# Altium schematic sheet 3_PowerDistribution.SchDoc
size A3; SheetNumber: 3; SheetTotal: 8
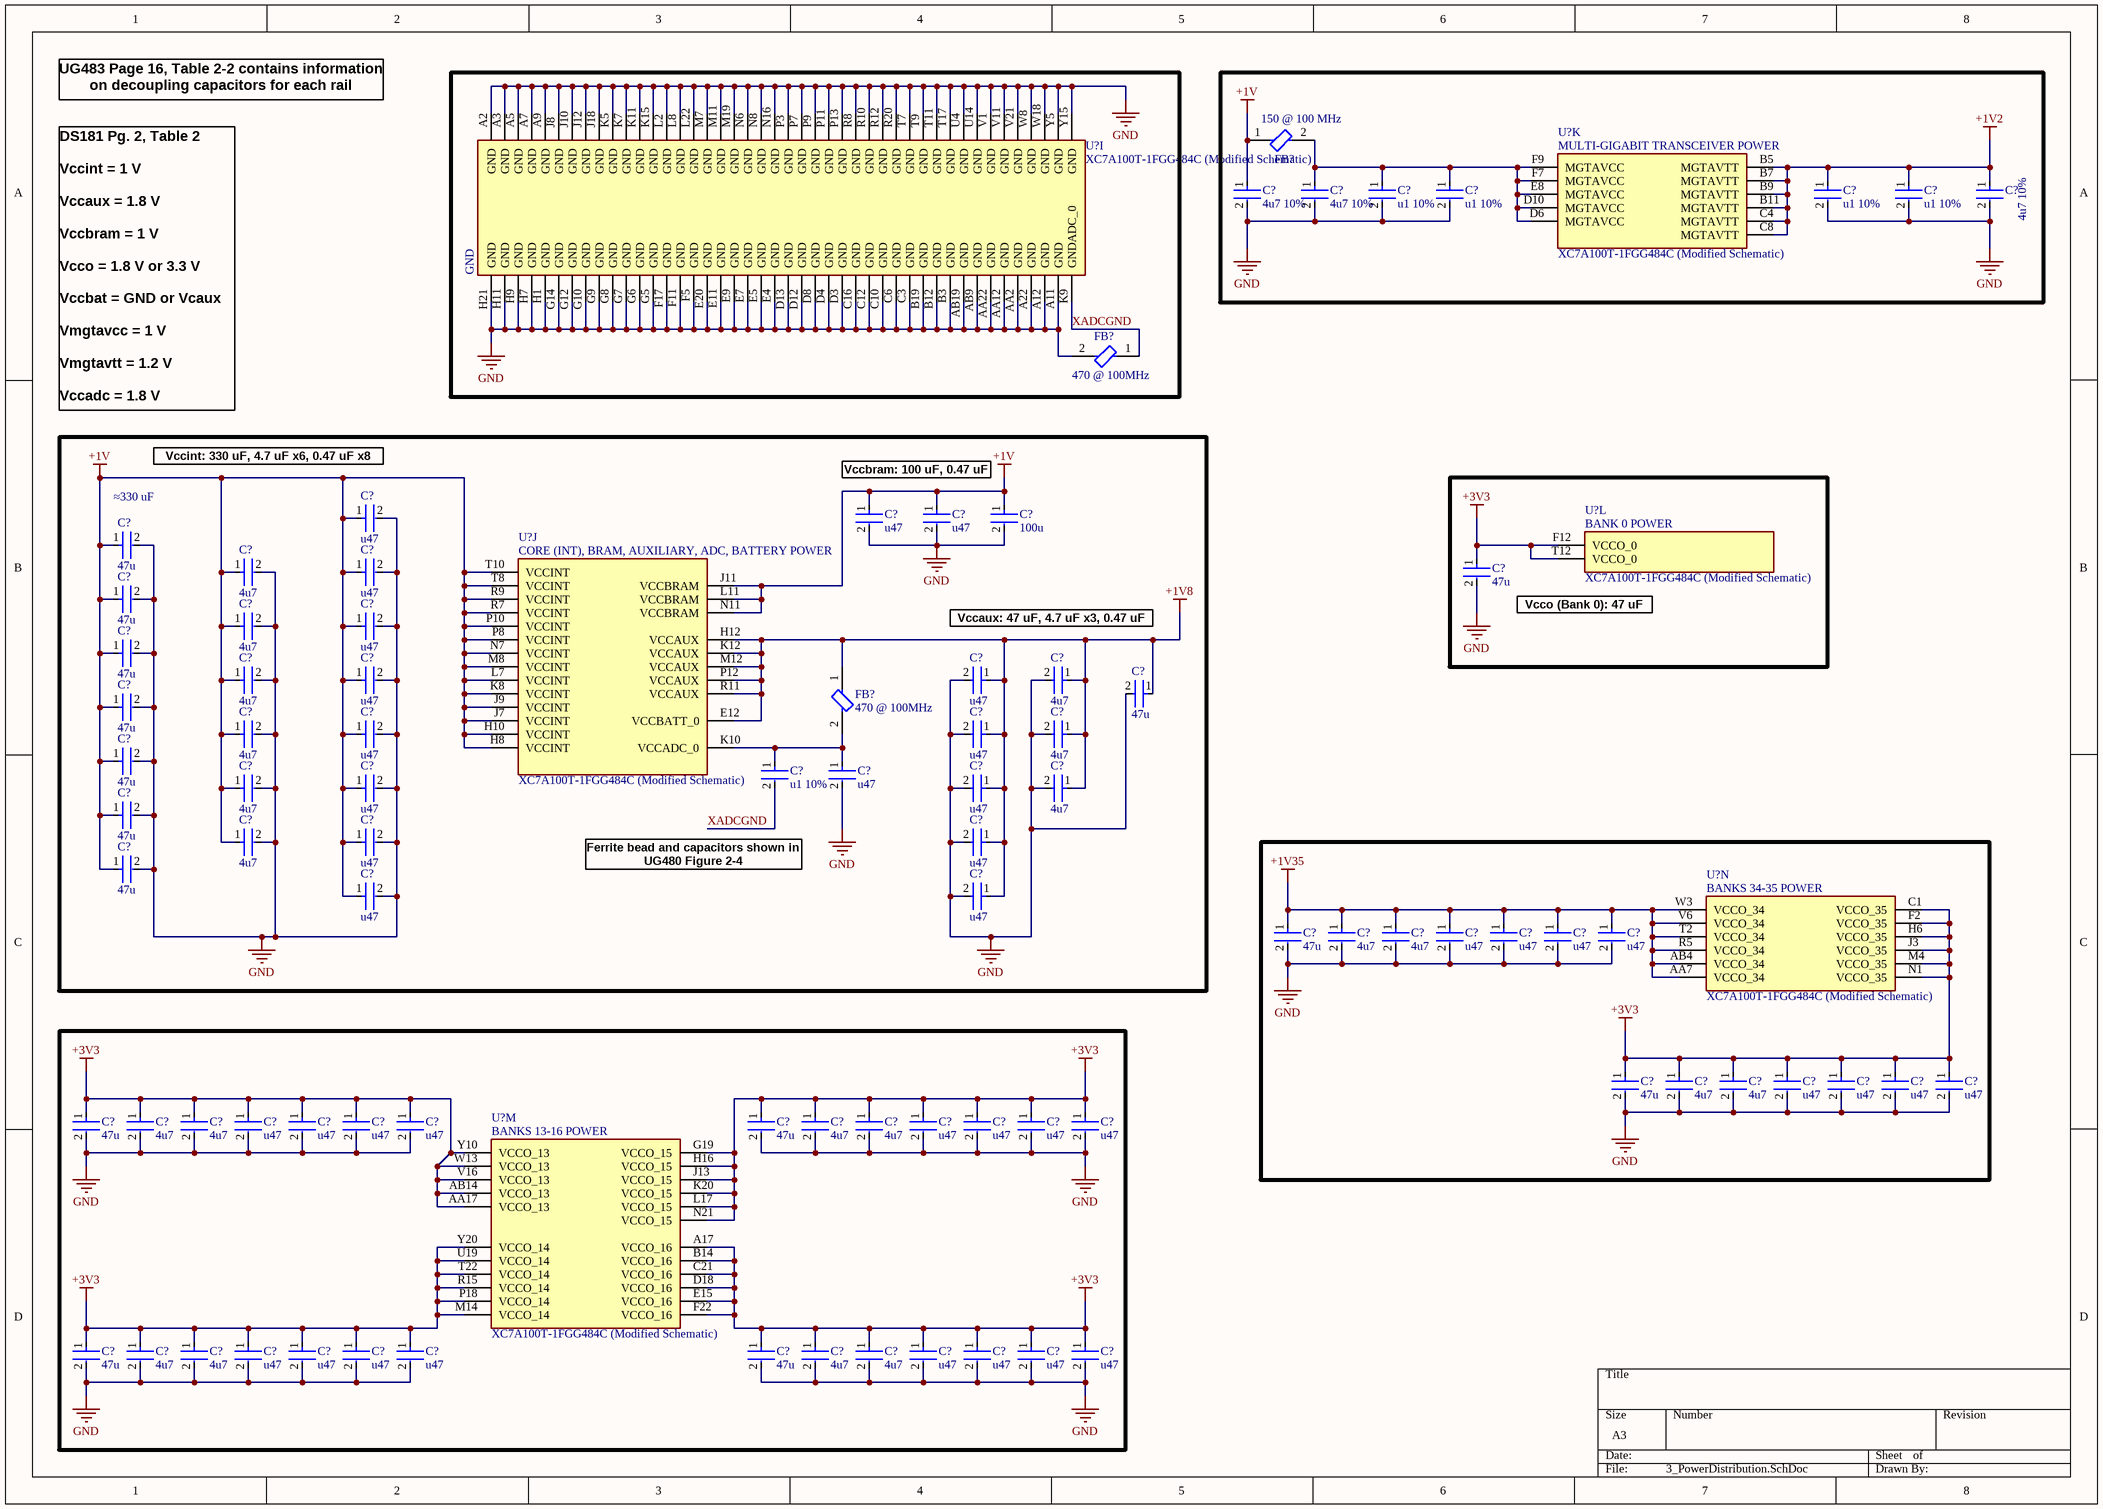
[diagram p0: 3_PowerDistribution.SchDoc]

## Parts
(Parts that share a designator on the sheet are numbered #1, #2 ... from top to bottom, then left to right.)
C?#1  4u7 10%  [FP-C1005-050-0_20-0_10-MFG]
C?#2  4u7 10%  [FP-C1005-050-0_20-0_10-MFG]
C?#3  u1 10%  [FP-CL891-IPC_C]
C?#4  u1 10%  [FP-CL891-IPC_C]
C?#5  u1 10%  [FP-CL891-IPC_C]
C?#6  u1 10%  [FP-CL891-IPC_C]
C?#7  4u7 10%  [FP-C1005-050-0_20-0_10-MFG]
C?#8  u47  [FP-C0603-030-0_03-IPC_A]
C?#9  u47  [FP-C0603-030-0_03-IPC_A]
C?#10  100u  [FP-GRM21B-0_2-e0_2_0_7-IPC_A]
C?#11  u47  [FP-C0603-030-0_03-IPC_A]
C?#12  47u  [FP-GRM188-0_2-IPC_B]
C?#13  47u  [FP-GRM188-0_2-IPC_B]
C?#14  4u7  [FP-CL829-IPC_C]
C?#15  u47  [FP-C0603-030-0_03-IPC_A]
C?#16  47u  [FP-GRM188-0_2-IPC_B]
C?#17  4u7  [FP-CL829-IPC_C]
C?#18  u47  [FP-C0603-030-0_03-IPC_A]
C?#19  47u  [FP-GRM188-0_2-IPC_B]
C?#20  4u7  [FP-CL829-IPC_C]
C?#21  u47  [FP-C0603-030-0_03-IPC_A]
C?#22  u47  [FP-C0603-030-0_03-IPC_A]
C?#23  4u7  [FP-CL829-IPC_C]
C?#24  47u  [FP-GRM188-0_2-IPC_B]
C?#25  47u  [FP-GRM188-0_2-IPC_B]
C?#26  4u7  [FP-CL829-IPC_C]
C?#27  u47  [FP-C0603-030-0_03-IPC_A]
C?#28  u47  [FP-C0603-030-0_03-IPC_A]
C?#29  4u7  [FP-CL829-IPC_C]
C?#30  47u  [FP-GRM188-0_2-IPC_B]
C?#31  u1 10%  [FP-CL891-IPC_C]
C?#32  u47  [FP-C0603-030-0_03-IPC_A]
C?#33  4u7  [FP-CL829-IPC_C]
C?#34  u47  [FP-C0603-030-0_03-IPC_A]
C?#35  u47  [FP-C0603-030-0_03-IPC_A]
C?#36  4u7  [FP-CL829-IPC_C]
C?#37  47u  [FP-GRM188-0_2-IPC_B]
C?#38  4u7  [FP-CL829-IPC_C]
C?#39  u47  [FP-C0603-030-0_03-IPC_A]
C?#40  u47  [FP-C0603-030-0_03-IPC_A]
C?#41  47u  [FP-GRM188-0_2-IPC_B]
C?#42  u47  [FP-C0603-030-0_03-IPC_A]
C?#43  u47  [FP-C0603-030-0_03-IPC_A]
C?#44  47u  [FP-GRM188-0_2-IPC_B]
C?#45  4u7  [FP-CL829-IPC_C]
C?#46  4u7  [FP-CL829-IPC_C]
C?#47  u47  [FP-C0603-030-0_03-IPC_A]
C?#48  u47  [FP-C0603-030-0_03-IPC_A]
C?#49  u47  [FP-C0603-030-0_03-IPC_A]
C?#50  u47  [FP-C0603-030-0_03-IPC_A]
C?#51  47u  [FP-GRM188-0_2-IPC_B]
C?#52  4u7  [FP-CL829-IPC_C]
C?#53  4u7  [FP-CL829-IPC_C]
C?#54  u47  [FP-C0603-030-0_03-IPC_A]
C?#55  u47  [FP-C0603-030-0_03-IPC_A]
C?#56  u47  [FP-C0603-030-0_03-IPC_A]
C?#57  u47  [FP-C0603-030-0_03-IPC_A]
C?#58  47u  [FP-GRM188-0_2-IPC_B]
C?#59  4u7  [FP-CL829-IPC_C]
C?#60  4u7  [FP-CL829-IPC_C]
C?#61  u47  [FP-C0603-030-0_03-IPC_A]
C?#62  u47  [FP-C0603-030-0_03-IPC_A]
C?#63  u47  [FP-C0603-030-0_03-IPC_A]
C?#64  u47  [FP-C0603-030-0_03-IPC_A]
C?#65  47u  [FP-GRM188-0_2-IPC_B]
C?#66  4u7  [FP-CL829-IPC_C]
C?#67  4u7  [FP-CL829-IPC_C]
C?#68  u47  [FP-C0603-030-0_03-IPC_A]
C?#69  u47  [FP-C0603-030-0_03-IPC_A]
C?#70  u47  [FP-C0603-030-0_03-IPC_A]
C?#71  u47  [FP-C0603-030-0_03-IPC_A]
C?#72  47u  [FP-GRM188-0_2-IPC_B]
C?#73  4u7  [FP-CL829-IPC_C]
C?#74  4u7  [FP-CL829-IPC_C]
C?#75  u47  [FP-C0603-030-0_03-IPC_A]
C?#76  u47  [FP-C0603-030-0_03-IPC_A]
C?#77  u47  [FP-C0603-030-0_03-IPC_A]
C?#78  u47  [FP-C0603-030-0_03-IPC_A]
C?#79  47u  [FP-GRM188-0_2-IPC_B]
C?#80  4u7  [FP-CL829-IPC_C]
C?#81  4u7  [FP-CL829-IPC_C]
C?#82  u47  [FP-C0603-030-0_03-IPC_A]
C?#83  u47  [FP-C0603-030-0_03-IPC_A]
C?#84  u47  [FP-C0603-030-0_03-IPC_A]
C?#85  u47  [FP-C0603-030-0_03-IPC_A]
FB?#1  150 @ 100 MHz  [FP-MPZ1005-IPC_B]
FB?#2  470 @ 100MHz  [FP-BLM41-0_2-a1_2-IPC_B]
FB?#3  470 @ 100MHz  [FP-BLM41-0_2-a1_2-IPC_B]
U?#1  XC7A100T-1FGG484C (Modified Schematic)  [BGA484C100P22X22_2300X2300X260N]  (part I of 14)
U?#2  XC7A100T-1FGG484C (Modified Schematic)  [BGA484C100P22X22_2300X2300X260N]  (part K of 14)
U?#3  XC7A100T-1FGG484C (Modified Schematic)  [BGA484C100P22X22_2300X2300X260N]  (part L of 14)
U?#4  XC7A100T-1FGG484C (Modified Schematic)  [BGA484C100P22X22_2300X2300X260N]  (part J of 14)
U?#5  XC7A100T-1FGG484C (Modified Schematic)  [BGA484C100P22X22_2300X2300X260N]  (part N of 14)
U?#6  XC7A100T-1FGG484C (Modified Schematic)  [BGA484C100P22X22_2300X2300X260N]  (part M of 14)

## Blocks framed on the sheet
≈330 uF: C?#8-C?#12 C?#14-C?#43 FB?#3 U?#4

## Nets
+1V: C?#1.1 C?#8.1 C?#9.1 C?#10.1 C?#11.1 C?#12.1 C?#14.1 C?#15.1 C?#16.1 C?#17.1 C?#18.1 C?#19.1 C?#20.1 C?#21.1 C?#25.1 C?#26.1 C?#27.1 C?#30.1 C?#33.1 C?#34.1 C?#37.1 C?#38.1 C?#39.1 C?#41.1 C?#42.1 FB?#1.1 U?#4.H8(VCCINT) U?#4.H10(VCCINT) U?#4.J7(VCCINT) U?#4.J9(VCCINT) U?#4.J11(VCCBRAM) U?#4.K8(VCCINT) U?#4.L7(VCCINT) U?#4.L11(VCCBRAM) U?#4.M8(VCCINT) U?#4.N7(VCCINT) U?#4.N11(VCCBRAM) U?#4.P8(VCCINT) U?#4.P10(VCCINT) U?#4.R7(VCCINT) U?#4.R9(VCCINT) U?#4.T8(VCCINT) U?#4.T10(VCCINT)
+1V2: C?#5.1 C?#6.1 C?#7.1 U?#2.B5(MGTAVTT) U?#2.B7(MGTAVTT) U?#2.B9(MGTAVTT) U?#2.B11(MGTAVTT) U?#2.C4(MGTAVTT) U?#2.C8(MGTAVTT)
+1V8: C?#22.1 C?#23.1 C?#24.1 C?#28.1 C?#29.1 C?#35.1 C?#36.1 C?#40.1 C?#43.1 FB?#3.1 U?#4.E12(VCCBATT_0) U?#4.H12(VCCAUX) U?#4.K12(VCCAUX) U?#4.M12(VCCAUX) U?#4.P12(VCCAUX) U?#4.R11(VCCAUX)
+1V35: C?#44.1 C?#45.1 C?#46.1 C?#47.1 C?#48.1 C?#49.1 C?#50.1 U?#5.AA7(VCCO_34) U?#5.AB4(VCCO_34) U?#5.R5(VCCO_34) U?#5.T2(VCCO_34) U?#5.V6(VCCO_34) U?#5.W3(VCCO_34)
+3V3: C?#13.1 C?#51.1 C?#52.1 C?#53.1 C?#54.1 C?#55.1 C?#56.1 C?#57.1 C?#58.1 C?#59.1 C?#60.1 C?#61.1 C?#62.1 C?#63.1 C?#64.1 C?#65.1 C?#66.1 C?#67.1 C?#68.1 C?#69.1 C?#70.1 C?#71.1 C?#72.1 C?#73.1 C?#74.1 C?#75.1 C?#76.1 C?#77.1 C?#78.1 C?#79.1 C?#80.1 C?#81.1 C?#82.1 C?#83.1 C?#84.1 C?#85.1 U?#3.F12(VCCO_0) U?#3.T12(VCCO_0) U?#5.C1(VCCO_35) U?#5.F2(VCCO_35) U?#5.H6(VCCO_35) U?#5.J3(VCCO_35) U?#5.M4(VCCO_35) U?#5.N1(VCCO_35) U?#6.A17(VCCO_16) U?#6.AA17(VCCO_13) U?#6.AB14(VCCO_13) U?#6.B14(VCCO_16) U?#6.C21(VCCO_16) U?#6.D18(VCCO_16) U?#6.E15(VCCO_16) U?#6.F22(VCCO_16) U?#6.G19(VCCO_15) U?#6.H16(VCCO_15) U?#6.J13(VCCO_15) U?#6.K20(VCCO_15) U?#6.L17(VCCO_15) U?#6.M14(VCCO_14) U?#6.N21(VCCO_15) U?#6.P18(VCCO_14) U?#6.R15(VCCO_14) U?#6.T22(VCCO_14) U?#6.U19(VCCO_14) U?#6.V16(VCCO_13) U?#6.W13(VCCO_13) U?#6.Y10(VCCO_13) U?#6.Y20(VCCO_14)
GND: C?#1.2 C?#2.2 C?#3.2 C?#4.2 C?#5.2 C?#6.2 C?#7.2 C?#8.2 C?#9.2 C?#10.2 C?#11.2 C?#12.2 C?#13.2 C?#14.2 C?#15.2 C?#16.2 C?#17.2 C?#18.2 C?#19.2 C?#20.2 C?#21.2 C?#22.2 C?#23.2 C?#24.2 C?#25.2 C?#26.2 C?#27.2 C?#28.2 C?#29.2 C?#30.2 C?#32.2 C?#33.2 C?#34.2 C?#35.2 C?#36.2 C?#37.2 C?#38.2 C?#39.2 C?#40.2 C?#41.2 C?#42.2 C?#43.2 C?#44.2 C?#45.2 C?#46.2 C?#47.2 C?#48.2 C?#49.2 C?#50.2 C?#51.2 C?#52.2 C?#53.2 C?#54.2 C?#55.2 C?#56.2 C?#57.2 C?#58.2 C?#59.2 C?#60.2 C?#61.2 C?#62.2 C?#63.2 C?#64.2 C?#65.2 C?#66.2 C?#67.2 C?#68.2 C?#69.2 C?#70.2 C?#71.2 C?#72.2 C?#73.2 C?#74.2 C?#75.2 C?#76.2 C?#77.2 C?#78.2 C?#79.2 C?#80.2 C?#81.2 C?#82.2 C?#83.2 C?#84.2 C?#85.2 FB?#2.2 U?#1.A2(GND) U?#1.A3(GND) U?#1.A5(GND) U?#1.A7(GND) U?#1.A9(GND) U?#1.A11(GND) U?#1.A12(GND) U?#1.A22(GND) U?#1.AA2(GND) U?#1.AA12(GND) U?#1.AA22(GND) U?#1.AB9(GND) U?#1.AB19(GND) U?#1.B3(GND) U?#1.B12(GND) U?#1.B19(GND) U?#1.C3(GND) U?#1.C6(GND) U?#1.C10(GND) U?#1.C12(GND) U?#1.C16(GND) U?#1.D3(GND) U?#1.D4(GND) U?#1.D8(GND) U?#1.D12(GND) U?#1.D13(GND) U?#1.E4(GND) U?#1.E5(GND) U?#1.E7(GND) U?#1.E9(GND) U?#1.E11(GND) U?#1.E20(GND) U?#1.F5(GND) U?#1.F11(GND) U?#1.F17(GND) U?#1.G5(GND) U?#1.G6(GND) U?#1.G7(GND) U?#1.G8(GND) U?#1.G9(GND) U?#1.G10(GND) U?#1.G12(GND) U?#1.G14(GND) U?#1.H1(GND) U?#1.H7(GND) U?#1.H9(GND) U?#1.H11(GND) U?#1.H21(GND) U?#1.J8(GND) U?#1.J10(GND) U?#1.J12(GND) U?#1.J18(GND) U?#1.K5(GND) U?#1.K7(GND) U?#1.K11(GND) U?#1.K15(GND) U?#1.L2(GND) U?#1.L8(GND) U?#1.L22(GND) U?#1.M7(GND) U?#1.M11(GND) U?#1.M19(GND) U?#1.N6(GND) U?#1.N8(GND) U?#1.N16(GND) U?#1.P3(GND) U?#1.P7(GND) U?#1.P9(GND) U?#1.P11(GND) U?#1.P13(GND) U?#1.R8(GND) U?#1.R10(GND) U?#1.R12(GND) U?#1.R20(GND) U?#1.T7(GND) U?#1.T9(GND) U?#1.T11(GND) U?#1.T17(GND) U?#1.U4(GND) U?#1.U14(GND) U?#1.V1(GND) U?#1.V11(GND) U?#1.V21(GND) U?#1.W8(GND) U?#1.W18(GND) U?#1.Y5(GND) U?#1.Y15(GND)
XADCGND: C?#31.2 FB?#2.1 U?#1.K9(GNDADC_0)
NetC?#2_1: C?#2.1 C?#3.1 C?#4.1 FB?#1.2 U?#2.D6(MGTAVCC) U?#2.D10(MGTAVCC) U?#2.E8(MGTAVCC) U?#2.F7(MGTAVCC) U?#2.F9(MGTAVCC)
NetC?#31_1: C?#31.1 C?#32.1 FB?#3.2 U?#4.K10(VCCADC_0)

## Notes on the sheet
- UG483 Page 16, Table 2-2 contains information on decoupling capacitors for each rail
- DS181 Pg. 2, Table 2
  Vccint = 1 V
  Vccaux = 1.8 V
  Vccbram = 1 V
  Vcco = 1.8 V or 3.3 V
  Vccbat = GND or Vcaux
  Vmgtavcc = 1 V
  Vmgtavtt = 1.2 V
  Vccadc = 1.8 V
- Vccint: 330 uF, 4.7 uF x6, 0.47 uF x8
- (near C?#9) Vccbram: 100 uF, 0.47 uF x2
- Vccaux: 47 uF, 4.7 uF x3, 0.47 uF x5
- Vcco (Bank 0): 47 uF
- Ferrite bead and capacitors shown in UG480 Figure 2-4
- (in symbol XC7A100T-1FGG484C, part J) CORE (INT), BRAM, AUXILIARY, ADC, BATTERY POWER
- (in symbol XC7A100T-1FGG484C, part K) MULTI-GIGABIT TRANSCEIVER POWER
- (in symbol XC7A100T-1FGG484C, part L) BANK 0 POWER
- (in symbol XC7A100T-1FGG484C, part M) BANKS 13-16 POWER
- (in symbol XC7A100T-1FGG484C, part N) BANKS 34-35 POWER

## Library data of the parts
C?#1 C?#2 C?#7 = CMP-08246-007228-1: C1005X5R1A475K050BE / CAP CER 4.7UF 10V X5R 0402; Max Operating Temperature: 85°C; Case Code (Metric): 1005; Voltage Rating: 10V; Tolerance: 10%; Packaging: Tape and Reel; Capacitance: 4.7uF; Case/Package: 0402; Features: Soft Termination; Min Operating Temperature: -55°C; Mount: Surface Mount; Case Code (Imperial): 0402; RoHS Compliant: Yes
C?#3-C?#6 C?#31 = CMP-13271-001945-1: CL05B104KB5NNNC / Cap Ceramic 100nF 50V X7R ±10% SMD 0402 +125°C Paper T/R
C?#8 C?#9 C?#11 C?#15 C?#18 C?#21 C?#22 C?#27 C?#28 C?#32 C?#34 C?#35 C?#39 C?#40 C?#42 C?#43 C?#47-C?#50 C?#54-C?#57 C?#61-C?#64 C?#68-C?#71 C?#75-C?#78 C?#82-C?#85 = CMP-08246-006895-1: C0603X5R1A474M030BC / Multilayer Ceramic Capacitors 470nF ±20% 10V X5R SMD 0201; Package Quantity: 1; Mount: Surface Mount; RoHS Compliant: Yes; Case/Package: 0201; Case Code (Metric): 0603; Max Operating Temperature: 85°C; Series: C; Min Operating Temperature: -55°C; Length: 0.024inch; Dielectric Material: Ceramic; REACH SVHC: No SVHC; Lead Free: Lead Free; Case Code (Imperial): 0201; Width: 0.012inch; Dielectric: X5R; Capacitance: 470nF; Tolerance: 20%; Thickness: 0.013inch; Voltage Rating: 10V; Packaging: Cut Tape; Voltage Rating (DC): 10V
C?#10 = CMP-2000-07599-2: GRM21BR60J107ME15L / Chip Multilayer Ceramic Capacitors for General Purpose, 0805, 100uF, X5R, 15%, 20%, 6.3V; Length: 0.079inch; Dielectric: X5R; Case Code (Metric): 2012; Max Operating Temperature: 85°C; Voltage Rating (DC): 6.3V; Min Operating Temperature: -55°C; Tolerance: 20%; Packaging: Cut Tape; Voltage Rating: 6.3V; Capacitance: 100uF; REACH SVHC: No SVHC; Width: 0.049inch; Mount: Surface Mount; Case/Package: 0805; Case Code (Imperial): 0805; Lead Free: Lead Free; Thickness: 0.057inch
C?#12 C?#13 C?#16 C?#19 C?#24 C?#25 C?#30 C?#37 C?#41 C?#44 C?#51 C?#58 C?#65 C?#72 C?#79 = CMP-2000-05444-2: GRM188R60J476ME15D / Chip Multilayer Ceramic Capacitors for General Purpose, 0603, 47uF, X5R, 15%, 20%, 6.3V; Voltage Rating (DC): 6.3V; Thickness: 0.039inch; Case Code (Imperial): 0603; Packaging: Tape and Reel; Capacitance: 47uF; Width: 0.031inch; Dielectric: X5R; Max Operating Temperature: 85°C; Mount: Surface Mount; Case Code (Metric): 1608; Length: 0.063inch; Voltage Rating: 6.3V; Tolerance: 20%; Case/Package: 0603; Min Operating Temperature: -55°C
C?#14 C?#17 C?#20 C?#23 C?#26 C?#29 C?#33 C?#36 C?#38 C?#45 C?#46 C?#52 C?#53 C?#59 C?#60 C?#66 C?#67 C?#73 C?#74 C?#80 C?#81 = CMP-13271-001468-1: CL05A475MO5NUNC / Cap Ceramic 4.7uF 16V X5R ±20% SMD 0402 +85°C Paper T/R; Mount: Surface Mount; Case Code (Metric): 1005; Case/Package: 0402; Length: 0.039inch; Capacitance: 4.7uF; Voltage Rating: 16V; Max Operating Temperature: 85°C; Tolerance: 20%; Thickness: 0.022inch; Min Operating Temperature: -55°C; Case Code (Imperial): 0402; Packaging: Tape and Reel; Width: 0.02inch
FB?#1 = CMP-08257-000209-1: MPZ1005A151ETD25 / Power line Ferrite Bead 150Ω @ 100MHz 0.8A DCR 0.18Ω AEC-Q200 SMD 0402; RoHS Compliant: Yes
FB?#2 FB?#3 = CMP-0686-00760-3: BLM41PG471SN1L / Ferrite Bead, 1806, 470Ω @ 100MHz, 25%, 0.05Ω, 2A; Material: Steel; Number of Circuits: 1; Shielding: Unshielded; DC Resistance (DCR): 50mR; Impedance: 470R; Min Operating Temperature: -55°C; Case/Package: 1806; Packaging: Tape and Reel; DC Current: 2A; Frequency: 100MHz; Length: 4.5mm; Max Operating Temperature: 125°C; Package Quantity: 1; Max Current Rating: 2A; Radiation Hardening: No; RoHS Compliant: Yes; Lead Free: Lead Free; Height: 1.6mm; Test Frequency: 100MHz; Series: BLM41P; Width: 1.6mm; Core Material: Ferrite; Case Code (Imperial): 1806; Termination: SMD/SMT; Tolerance: 25%; Number of Pins: 2; Number of Lines: 1; Case Code (Metric): 4516; Current Rating: 2A; Max DC Current: 2A; DC Resistance-Max: 50mR; Depth: 1.6mm; Military Standard: Not
U?#1-U?#6 = XC7A100T-1FGG484C: Artix-7 Field Programmable Gate Array (FPGA) IC 285 4976640 101440 484-BBGA; MF: Xilinx Inc.; Check_prices: https://www.snapeda.com/parts/XC7A100T-1FGG484C/Xilinx/view-part/?ref=eda; MP: XC7A100T-1FGG484C; Package: FBGA-484 Xilinx; SnapEDA_Link: https://www.snapeda.com/parts/XC7A100T-1FGG484C/Xilinx/view-part/?ref=snap; Value: *